# Altium schematic sheet Sensors.SchDoc
size A4
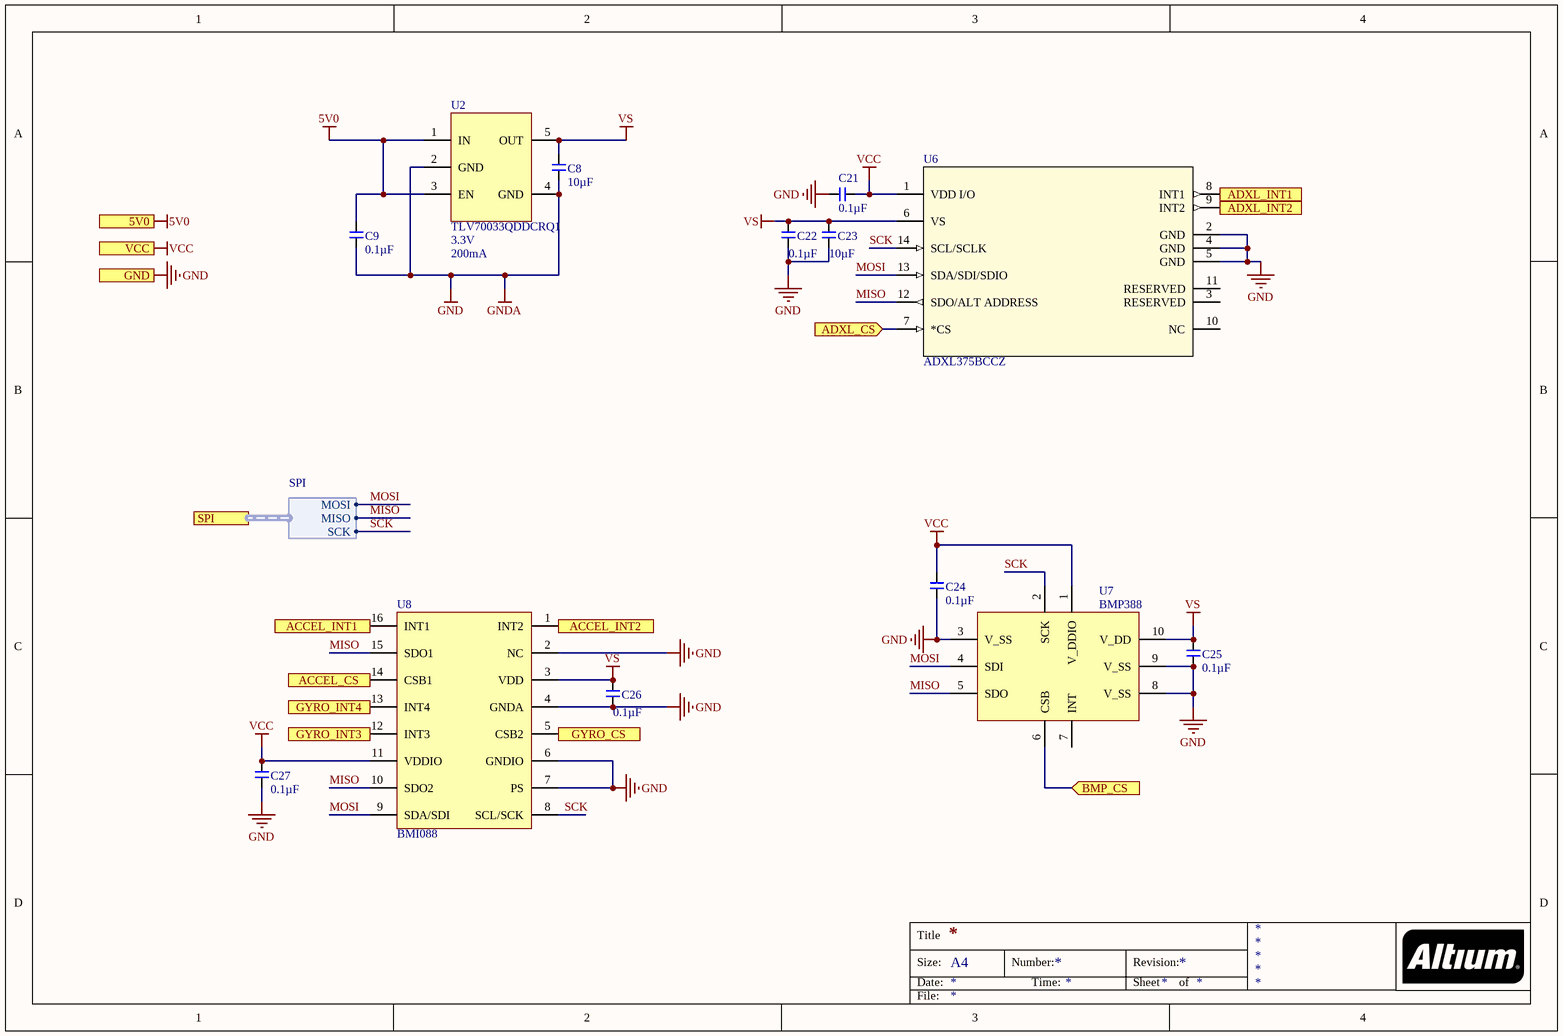
[diagram p0: Sensors.SchDoc]

## Parts
C8  Capacitance (shorthand): 10µF  [C0603]  (hidden comment: __template_cap)
C9  Capacitance (shorthand): 0.1µF  [C0603]  (hidden comment: __template_cap)
C21  Capacitance (shorthand): 0.1µF  [C0603]  (hidden comment: __template_cap)
C22  Capacitance (shorthand): 0.1µF  [C0603]  (hidden comment: __template_cap)
C23  Capacitance (shorthand): 10µF  [C0603]  (hidden comment: __template_cap)
C24  Capacitance (shorthand): 0.1µF  [C0603]  (hidden comment: __template_cap)
C25  Capacitance (shorthand): 0.1µF  [C0603]  (hidden comment: __template_cap)
C26  Capacitance (shorthand): 0.1µF  [C0603]  (hidden comment: __template_cap)
C27  Capacitance (shorthand): 0.1µF  [C0603]  (hidden comment: __template_cap)
U2  Manufacturer Part Number: TLV70033QDDCRQ1  Voltage - Output: 3.3V  Current - Output: 200mA  [5SOT23]  (hidden comment: REG102GA-3.3)
U6  ADXL375BCCZ  [LGA_CC-14-1]
U7  BMP388  [8 pin LGA]
U8  BMI088  [BMI088]

## Ports
5V0 (in), ACCEL_CS (in), ACCEL_INT1 (out), ACCEL_INT2 (out), ADXL_CS (in), ADXL_INT1 (out), ADXL_INT2 (out), BMP_CS (in), GND (in), GYRO_CS (in), GYRO_INT3 (out), GYRO_INT4 (out), SPI (harness SPI), VCC (in)

## Harnesses
SPI: MISO, MOSI, SCK

## Nets
5V0: C9.1 U2.1(IN) U2.3(EN) ; port 5V0
GND: C8.2 C9.2 C21.2 C22.1 C23.2 C24.2 C25.2 C26.2 C27.2 U2.2(GND) U2.4(GND) U6.2(GND) U6.4(GND) U6.5(GND) U7.3(V_SS) U7.8(V_SS) U7.9(V_SS) U8.2(NC) U8.4(GNDA) U8.6(GNDIO) U8.7(PS) ; port GND  [also labelled GNDA]
VCC: C21.1 C24.1 C27.1 U6.1(VDD_I/O) U7.1(V_DDIO) U8.11(VDDIO) ; port VCC
VS: C8.1 C22.2 C23.1 C25.1 C26.1 U2.5(OUT) U6.6(VS) U7.10(V_DD) U8.3(VDD)
ACCEL_CS: U8.14(CSB1) ; port ACCEL_CS
ACCEL_INT1: U8.16(INT1) ; port ACCEL_INT1
ACCEL_INT2: U8.1(INT2) ; port ACCEL_INT2
ADXL_CS: U6.7(*CS) ; port ADXL_CS
ADXL_INT1: U6.8(INT1) ; port ADXL_INT1
ADXL_INT2: U6.9(INT2) ; port ADXL_INT2
BMP_CS: U7.6(CSB) ; port BMP_CS
GYRO_CS: U8.5(CSB2) ; port GYRO_CS
GYRO_INT3: U8.12(INT3) ; port GYRO_INT3
GYRO_INT4: U8.13(INT4) ; port GYRO_INT4
MISO: U6.12(SDO/ALT_ADDRESS) U7.5(SDO) U8.10(SDO2) U8.15(SDO1) ; port SPI.MISO
MOSI: U6.13(SDA/SDI/SDIO) U7.4(SDI) U8.9(SDA/SDI) ; port SPI.MOSI
SCK: U6.14(SCL/SCLK) U7.2(SCK) U8.8(SCL/SCK) ; port SPI.SCK

Not connected (* = marked no-connect by the designer): U6 3(RESERVED) 10(NC) 11(RESERVED); U7 7(INT)

## Notes on the sheet
- Title
- Size:
- Date:
- A4
- Number:
- Time:
- Revision:
- Sheet
- of
- File:

## Library data of the parts
C8 C23 = CAP CER 10UF 35V X5R 0603 20%: Manufacturer: Murata Electronics North America; Capacitance - pF (Machine readable): 10000000; type: capacitor; Dielectric: X5R; Supplier 1: Digikey; Supplier Part Number 1: 490-13248-1-ND
C9 C21 C22 C24-C27 = CAP CER 0603 0.1µF X7R 50V 10%: Manufacturer: Murata Electronics North America; Capacitance - pF (Machine readable): 100000; type: capacitor; Dielectric: X7R; Supplier 1: Digikey; Supplier Part Number 1: 490-1519-1-ND
U2 = LDO_TLV70033QDDCRQ1: IC REG LDO 3.3V .2A SOT23-5; Manufacturer: Texas Instruments; Regulator Topology: Positive Fixed; Number of Regulators: 1; Voltage - Input: Up to 5.5V; Current - Limit (Min): 220mA; ComponentLink1URL: http://www.ti.com/lit/ds/symlink/tlv70033-q1.pdf; ComponentLink1Description: Datasheet; Supplier 1: Digi-Key; RoHS: RoHS Compliant; Category: Integrated Circuits (ICs); Stock 1: 889; Pricing 1: 1=0.58, 10=0.507, 25=0.444, 100=0.1661, 250=0.16296, 500=0.1599, 750=0.15683 (USD); Packaging: Cut Tape (CT); Voltage - Dropout (Typical): -; Operating Temperature: -40°C ~ 125°C; Mounting Type: Surface Mount; Package / Case: SOT-23-5 Thin, TSOT-23-5; Supplier Device Package: SOT-5; Supplier Part Number 1: 296-27780-1-ND
U6 = ADXL375BCCZ: 200G Accelcerometer; Value: Value; Type: Type; RefDes: RefDes; ComponentLink1Description: Datasheet; ComponentLink1URL: http://www.analog.com/media/en/technical-documentation/data-sheets/ADXL375.PDF
U7 = BMP388: Pressure Sensor 4.35 PSI ~ 18.13 PSI (30 kPa ~ 125 kPa) Absolute 10-WFLGA; Manufacturer: Bosch Sensortec; Supplier 1: Digi-Key; Manufacturer Part Number: BMP388; Stock 1: 46050; Pricing 1: 1=3.93, 5=3.466, 10=3.061, 25=2.4832, 50=2.1946, 100=2.1368, 500=1.7903, 1000=1.6748, 5000=1.5593 (USD); ComponentLink1URL: https://ae-bst.resource.bosch.com/media/_tech/media/product_flyer/BST-BMP388-FL000-00.pdf; ComponentLink1Description: https://ae-bst.resource.bosch.com/media/_tech/media/product_flyer/BST-BMP388-FL000-00.pdf
U8 = IMU_BMI088: Bosch BMI088; Supplier 1: Digi-Key; Supplier Part Number 1: 828-1082-1-ND; ComponentLink1Description: Datasheet; ComponentLink1URL: https://ae-bst.resource.bosch.com/media/_tech/media/datasheets/BST-BMI088-DS001-13.pdf